# EAGLE design FPC_Jumper_Board (EAGLE 9.6.2)
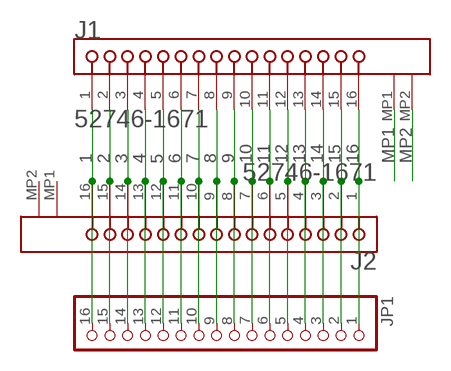
[diagram p0: schematic, sheet 1]

## Parts
J1  MOLEX_52746-1671MOLEX_52746-1671_0_0  [MOLEX_52746-1671_0]
J2  MOLEX_52746-1671MOLEX_52746-1671_0_0  [MOLEX_52746-1671_0]
JP1  PINHD-1X16  [1X16]

## Nets
1: J1.1 J2.16 JP1.16
2: J1.2 J2.15 JP1.15
3: J1.3 J2.14 JP1.14
4: J1.4 J2.13 JP1.13
5: J1.5 J2.12 JP1.12
6: J1.6 J2.11 JP1.11
7: J1.7 J2.10 JP1.10
8: J1.8 J2.9 JP1.9
9: J1.9 J2.8 JP1.8
10: J1.10 J2.7 JP1.7
11: J1.11 J2.6 JP1.6
12: J1.12 J2.5 JP1.5
13: J1.13 J2.4 JP1.4
14: J1.14 J2.3 JP1.3
15: J1.15 J2.2 JP1.2
16: J1.16 J2.1 JP1.1
MP1: J1.MP1
MP2: J1.MP2
Unconnected: J2.MP1 J2.MP2

## Library data of the parts
J1 J2 = Molex - 52746-1671:MOLEX_52746-1671: MOLX-52746-1671; CIIVA_IDS: 1134637; CIRCUITS_LOADED: 16; COMPONENT_LINK_1_DESCRIPTION: Manufacturer URL; COMPONENT_LINK_1_URL: http://www.molex.com/molex/index.jsp; COMPONENT_LINK_3_DESCRIPTION: Package Specification; COMPONENT_LINK_3_URL: http://www.molex.com/pdm_docs/sd/527461671_sd.pdf; CONTACT_POSITION: Bottom; CURRENT_MAX_PER_CONTACT: 0.5A; DATASHEET: http://www.molex.com/webdocs/datasheets/pdf/en-us/0527461671_FFC_FPC_CONNECTORS.pdf; DURABILITY_MATING_CYCLES_MAX: 20; ENTRY_ANGLE: 90degrees Angle; FOOTPRINT_VARIANT_NAME_0: Manufacturer Recommended; IMPORTED: yes; IMPORTED_FROM: vault; IMPORT_TS: 1521847824; MATED_HEIGHT: 2.00mm; MATERIAL___METAL: Phosphor Bronze; MATERIAL___PLATING_MATING: Gold; MATERIAL___PLATING_TERMINATION: Gold; MF: Molex; MOUNTING_TECHNOLOGY: Surface Mount; MPN: 52746-1671; NUMBER_OF_ROWS: 1; ORIENTATION: Right Angle; PACKAGE: 52746-1671; PACKAGE_DESCRIPTION: 16-Lead FPC Connector, Pitch 0.5 mm; PACKAGE_VERSION: Rev. H, 05/2009; PACKING: Tape and Reel; PCB_LOCATOR: No; PCB_RETENTION: Yes; PITCH___MATING_INTERFACE: 0.50mm; POLARIZED_TO_PCB: Yes; PREFIX: J; RELEASE_DATE: 1411386965; ROHS: Yes; STACKABLE: No; VAULT_GUID: 42AFEF3A-7427-4485-B9DD-4384D0932A2E; VAULT_REVISION: AA2C4A7A-D62C-479B-A4C7-3B738B5CC8F1; VOLTAGE_MAX: 50V
JP1 = pinhead:PINHD-1X16: PIN HEADER

## Board
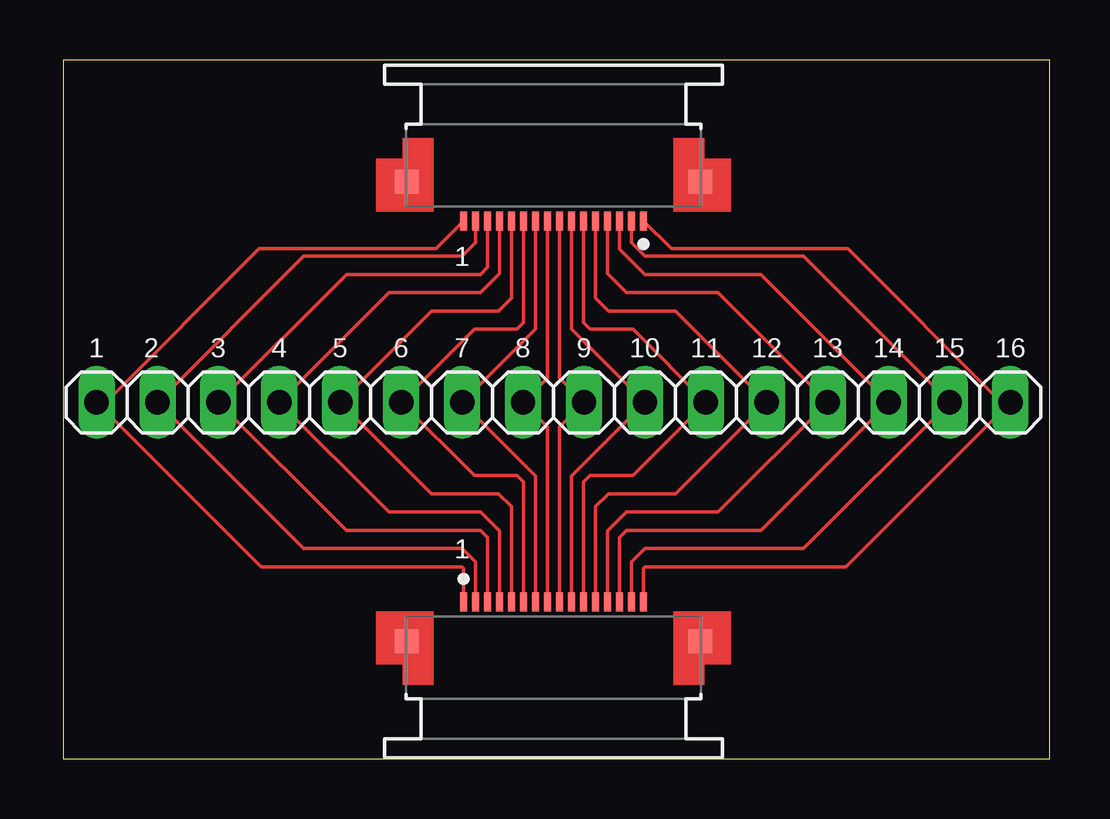
[diagram p1: board, top side]

Size 41.13 x 29.13 mm. Coordinates in mm from the lower left corner, seen from the top.
Outline: 0,0 41.13,0 41.13,29.13 0,29.13 0,0
Copper layers (1*16): Top 0.035mm / dielectric 1.5mm / Bottom 0.035mm
Design rules "SparkFun-2-layer-PCBWay-LIMIT": minimum track width 6mil, minimum drill 0.3mm, track to track 6mil, track to pad 6mil, pad to pad 6mil, via to via 6mil, smd to smd 6mil, copper to edge 6mil, drill to drill 6mil, minimum pad ring 6mil, minimum via ring 6mil, stop-mask expansion 4mil, vias tented up to drill 25mil, thermal gap 10mil

### Footprints (pad centres in the part's own frame; a part is rotated, then mirrored left to right if it is on the bottom)
MOLEX_52746-1671_0 = smd 0.3 x 0.8: 1 -3.75,0.824; 2 -3.25,0.824; 3 -2.75,0.824; 4 -2.25,0.824; 5 -1.75,0.824; 6 -1.25,0.824; 7 -0.75,0.824; 8 -0.25,0.824; 9 0.25,0.824; 10 0.75,0.824; 11 1.25,0.824; 12 1.75,0.824; 13 2.25,0.824; 14 2.75,0.824; 15 3.25,0.824; 16 3.75,0.824 | smd 1 x 1: MP1 -6.134,-0.824; MP2 6.134,-0.824
1X16 = drill 1.016 long: 1 -19.05,0; 2 -16.51,0; 3 -13.97,0; 4 -11.43,0; 5 -8.89,0; 6 -6.35,0; 7 -3.81,0; 8 -1.27,0; 9 1.27,0; 10 3.81,0; 11 6.35,0; 12 8.89,0; 13 11.43,0; 14 13.97,0; 15 16.51,0; 16 19.05,0

### Placement (x,y rotation side)
J1  20.45,5.71 0 top
J2  20.45,23.24 180 top
JP1  20.45,14.86 180 top

### Tracks (layer width: path | path; a pad name or v marks a point on that pad's centre or on a via)
1
  Top 0.152: J2.16 15.54,21.26 8.18,21.26 1.77,14.86 JP1.16 8.26,8 16.64,8 16.7,7.94 J1.1
2
  Top 0.152: J2.15 17.2,21.52 16.64,20.95 10.03,20.95 JP1.15 10.03,8.76 16.64,8.76 17.2,8.2 J1.2
3
  Top 0.152: J2.14 17.7,20.49 17.4,20.19 11.81,20.19 JP1.14 11.81,9.53 17.4,9.53 17.7,9.23 J1.3
4
  Top 0.152: J2.13 18.2,20.23 17.4,19.43 13.59,19.43 JP1.13 13.59,10.29 17.4,10.29 18.2,9.49 J1.4
5
  Top 0.152: J2.12 18.7,19.2 18.16,18.67 15.37,18.67 JP1.12 15.37,11.05 18.16,11.05 18.7,10.51 J1.5
6
  Top 0.152: J2.11 19.2,18.18 18.92,17.91 17.14,17.91 JP1.11 17.14,11.81 18.92,11.81 19.2,11.54 J1.6
7
  Top 0.152: J1.7 19.7,11.8 JP1.10 19.7,17.92 J2.10
8
  Top 0.152: J2.9 20.2,15.88 JP1.9 20.2,13.84 J1.8
9
  Top 0.152: J2.8 20.7,15.88 JP1.8 20.7,13.84 J1.9
10
  Top 0.152: J1.10 21.2,11.8 JP1.7 21.2,17.92 J2.7
11
  Top 0.152: J2.6 21.7,18.18 21.97,17.91 23.75,17.91 JP1.6 23.75,11.81 21.97,11.81 21.7,11.54 J1.11
12
  Top 0.152: J2.5 22.2,19.2 22.73,18.67 25.53,18.67 JP1.5 25.53,11.05 22.73,11.05 22.2,10.51 J1.12
13
  Top 0.152: J2.4 22.7,20.23 23.5,19.43 27.3,19.43 JP1.4 27.3,10.29 23.5,10.29 22.7,9.49 J1.13
14
  Top 0.152: J2.3 23.2,21.25 24.26,20.19 29.08,20.19 JP1.3 29.08,9.53 23.5,9.53 23.2,9.23 J1.14
15
  Top 0.152: J2.2 23.7,21.52 24.26,20.95 30.86,20.95 JP1.2 30.86,8.76 24.26,8.76 23.7,8.2 J1.15
16
  Top 0.152: J2.1 25.35,21.26 32.72,21.26 39.12,14.86 JP1.1 32.64,8 24.26,8 24.2,7.94 J1.16

### Text on the board
tPlace: 1 | 1 | 2 | 3 | 4 | 5 | 6 | 7 | 8 | 9 | 10 | 11 | 12 | 13 | 14 | 15 | 16 | 1